# EAGLE schematic power_stabilization(iteration3) (EAGLE 9.6.2)
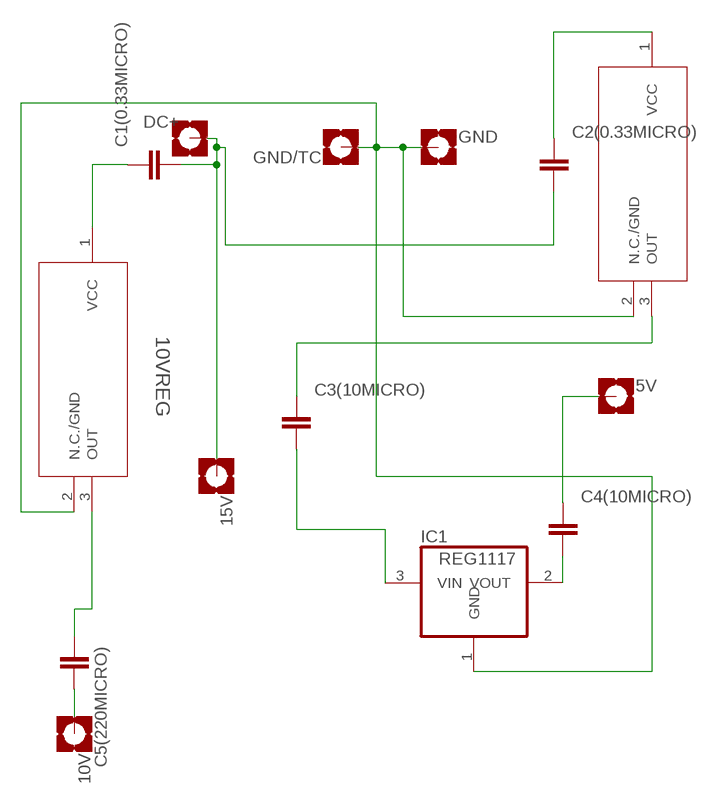
[diagram p0: schematic, sheet 1]

## Parts
5V  MOUNT-PAD-SQUARE2.8  [2,8-PAD-SQUARE]
10V  MOUNT-PAD-SQUARE2.8  [2,8-PAD-SQUARE]
10VREG  BAJ0BC0T  [TO220FP-3_ROM]
10VREG1  BAJ0BC0T  [TO220FP-3_ROM]
15V  MOUNT-PAD-SQUARE2.8  [2,8-PAD-SQUARE]
C1(0.33MICRO)  C  (no package)
C2(0.33MICRO)  C  (no package)
C3(10MICRO)  C  (no package)
C4(10MICRO)  C  (no package)
C5(220MICRO)  C-EUC1812K  [C1812K]
DC+  MOUNT-PAD-SQUARE2.8  [2,8-PAD-SQUARE]
GND  MOUNT-PAD-SQUARE2.8  [2,8-PAD-SQUARE]
GND/TC  MOUNT-PAD-SQUARE2.8  [2,8-PAD-SQUARE]
IC1  REG1117  [SOT223_HEATSINK]

## Nets
N$1: 10VREG.1(VCC) C1(0.33MICRO).1
N$2: 10VREG1.2(N.C./GND) 10VREG.2(N.C./GND) GND.B2,8(MOUNT) GND/TC.B2,8(MOUNT) IC1.1(GND)
N$3: 15V.B2,8(MOUNT) C1(0.33MICRO).2 C2(0.33MICRO).2 DC+.B2,8(MOUNT)
N$4: 10VREG.3(OUT) C5(220MICRO).1
N$5: 10VREG1.3(OUT) C3(10MICRO).1
N$6: 10V.B2,8(MOUNT) C5(220MICRO).2
N$7: 5V.B2,8(MOUNT) C4(10MICRO).1
N$8: 10VREG1.1(VCC) C2(0.33MICRO).1
N$9: C3(10MICRO).2 IC1.3(VIN)
N$10: C4(10MICRO).2 IC1.2(VOUT)

## Library data of the parts
5V 10V 15V DC+ GND GND/TC = holes:MOUNT-PAD-SQUARE: MOUNTING PAD, square
10VREG 10VREG1 = scipt_lib:BAJ0BC0T; BUILT_BY: EMA_Molly; COPYRIGHT: Copyright (C) 2018 Accelerated Designs. All rights reserved; MANUFACTURER_PART_NUMBER: BAJ0BC0T; SOURCELIBRARY: ROHM_2019-10-21; VENDOR: ROHM Semiconductor
C1(0.33MICRO) C2(0.33MICRO) C3(10MICRO) C4(10MICRO) = ngspice-simulation:C: CAPACITOR
C5(220MICRO) = rcl:C-EU: CAPACITOR, European symbol; SPICEPREFIX: C
IC1 = burr-brown-3:REG1117: 800mA and 1A Low Dropout (LDO) Positive Regulator 1.8V, 2.5V, 2.85V, 3.3V, 5V, and Adj